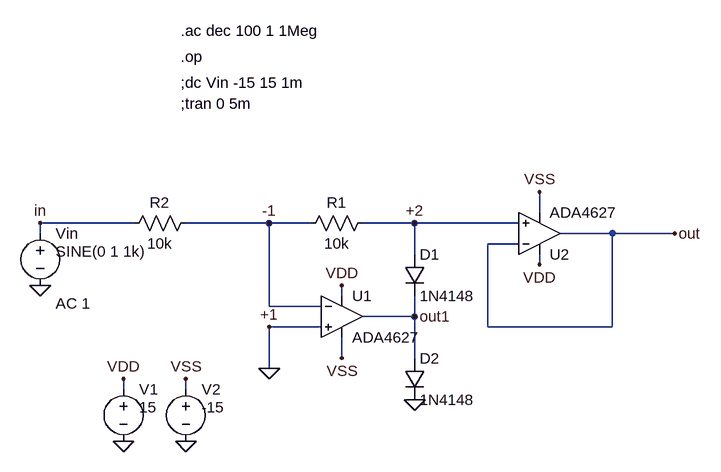
[diagram p0: schematic Etaj4-Redresor dubla alternanta AC.asc]
Etaj4-Redresor dubla alternanta AC.asc, the LTspice schematic file:
Version 4
SHEET 1 880 1068
WIRE -240 416 -240 384
WIRE -864 432 -1008 432
WIRE -656 432 -784 432
WIRE -592 432 -656 432
WIRE -432 432 -512 432
WIRE -272 432 -432 432
WIRE -1008 448 -1008 432
WIRE -128 448 -208 448
WIRE -32 448 -128 448
WIRE -272 464 -320 464
WIRE -432 480 -432 432
WIRE -240 496 -240 480
WIRE -544 544 -544 528
WIRE -656 560 -656 432
WIRE -576 560 -656 560
WIRE -432 576 -432 544
WIRE -432 576 -512 576
WIRE -576 592 -656 592
WIRE -320 592 -320 464
WIRE -128 592 -128 448
WIRE -128 592 -320 592
WIRE -544 640 -544 608
WIRE -432 640 -432 576
WIRE -656 656 -656 592
WIRE -880 688 -880 672
WIRE -784 688 -784 672
FLAG -240 496 VDD
FLAG -240 384 VSS
FLAG -432 704 0
FLAG -1008 528 0
FLAG -32 448 out
FLAG -1008 432 in
FLAG -656 656 0
FLAG -544 528 VDD
FLAG -544 640 VSS
FLAG -880 768 0
FLAG -880 672 VDD
FLAG -784 768 0
FLAG -784 672 VSS
FLAG -432 576 out1
FLAG -432 432 +2
FLAG -656 432 -1
FLAG -656 592 +1
SYMBOL voltage -1008 432 R0
WINDOW 123 24 124 Left 2
WINDOW 39 0 0 Left 2
WINDOW 3 24 44 Left 2
SYMATTR Value2 AC 1
SYMATTR Value SINE(0 1 1k)
SYMATTR InstName Vin
SYMBOL diode -448 480 R0
SYMATTR InstName D1
SYMATTR Value 1N4148
SYMBOL diode -448 640 R0
SYMATTR InstName D2
SYMATTR Value 1N4148
SYMBOL res -496 416 R90
WINDOW 0 0 56 VBottom 2
WINDOW 3 32 56 VTop 2
SYMATTR InstName R1
SYMATTR Value 10k
SYMBOL res -768 416 R90
WINDOW 0 0 56 VBottom 2
WINDOW 3 32 56 VTop 2
SYMATTR InstName R2
SYMATTR Value 10k
SYMBOL voltage -880 672 R0
WINDOW 123 24 124 Left 2
WINDOW 39 0 0 Left 2
WINDOW 3 24 44 Left 2
SYMATTR Value 15
SYMATTR InstName V1
SYMBOL voltage -784 672 R0
WINDOW 123 24 124 Left 2
WINDOW 39 0 0 Left 2
WINDOW 3 24 44 Left 2
SYMATTR Value -15
SYMATTR InstName V2
SYMBOL OpAmps\\ADA4627 -544 512 R0
SYMATTR InstName U1
SYMBOL OpAmps\\ADA4627 -240 512 M180
SYMATTR InstName U2
TEXT -792 136 Left 2 !.ac dec 100 1 1Meg
TEXT -792 176 Left 2 !.op
TEXT -792 216 Left 2 !;dc Vin -15 15 1m
TEXT -792 248 Left 2 !;tran 0 5m

The netlist it stands for:
* Etaj4-Redresor dubla alternanta AC.asc
Vin in 0 SINE(0 1 1k) AC 1
D1 +2 out1 1N4148
D2 out1 0 1N4148
R1 +2 -1 10k
R2 -1 in 10k
V1 VDD 0 15
V2 VSS 0 -15
XU1 0 -1 VDD VSS out1 ADA4627  ; pins In+ In- V+ V- OUT
XU2 +2 out VDD VSS out ADA4627  ; pins In+ In- V+ V- OUT
.model D D
.lib standard.dio
.ac dec 100 1 1Meg
.op
;dc Vin -15 15 1m
;tran 0 5m
.backanno
.end